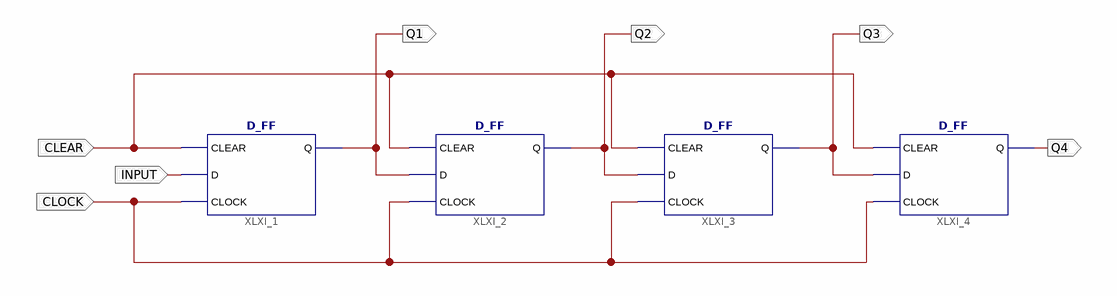
[diagram p0: schematic sheet 1]
// Xilinx ISE schematic SIPO.sch (artix7) as structural Verilog: 4 symbols, 7 ports
module SIPO (
  input  CLEAR,
  input  CLOCK,
  input  INPUT,
  output Q1,
  output Q2,
  output Q3,
  output Q4
);

  D_FF XLXI_1 (.CLEAR(CLEAR), .CLOCK(CLOCK), .D(INPUT), .Q(Q1));
  D_FF XLXI_2 (.CLEAR(CLEAR), .CLOCK(CLOCK), .D(Q1), .Q(Q2));
  D_FF XLXI_3 (.CLEAR(CLEAR), .CLOCK(CLOCK), .D(Q2), .Q(Q3));
  D_FF XLXI_4 (.CLEAR(CLEAR), .CLOCK(CLOCK), .D(Q3), .Q(Q4));
endmodule
